# Altium schematic sheet WiFiSameScreen _STC15W4K48S4.SchDoc
size A3
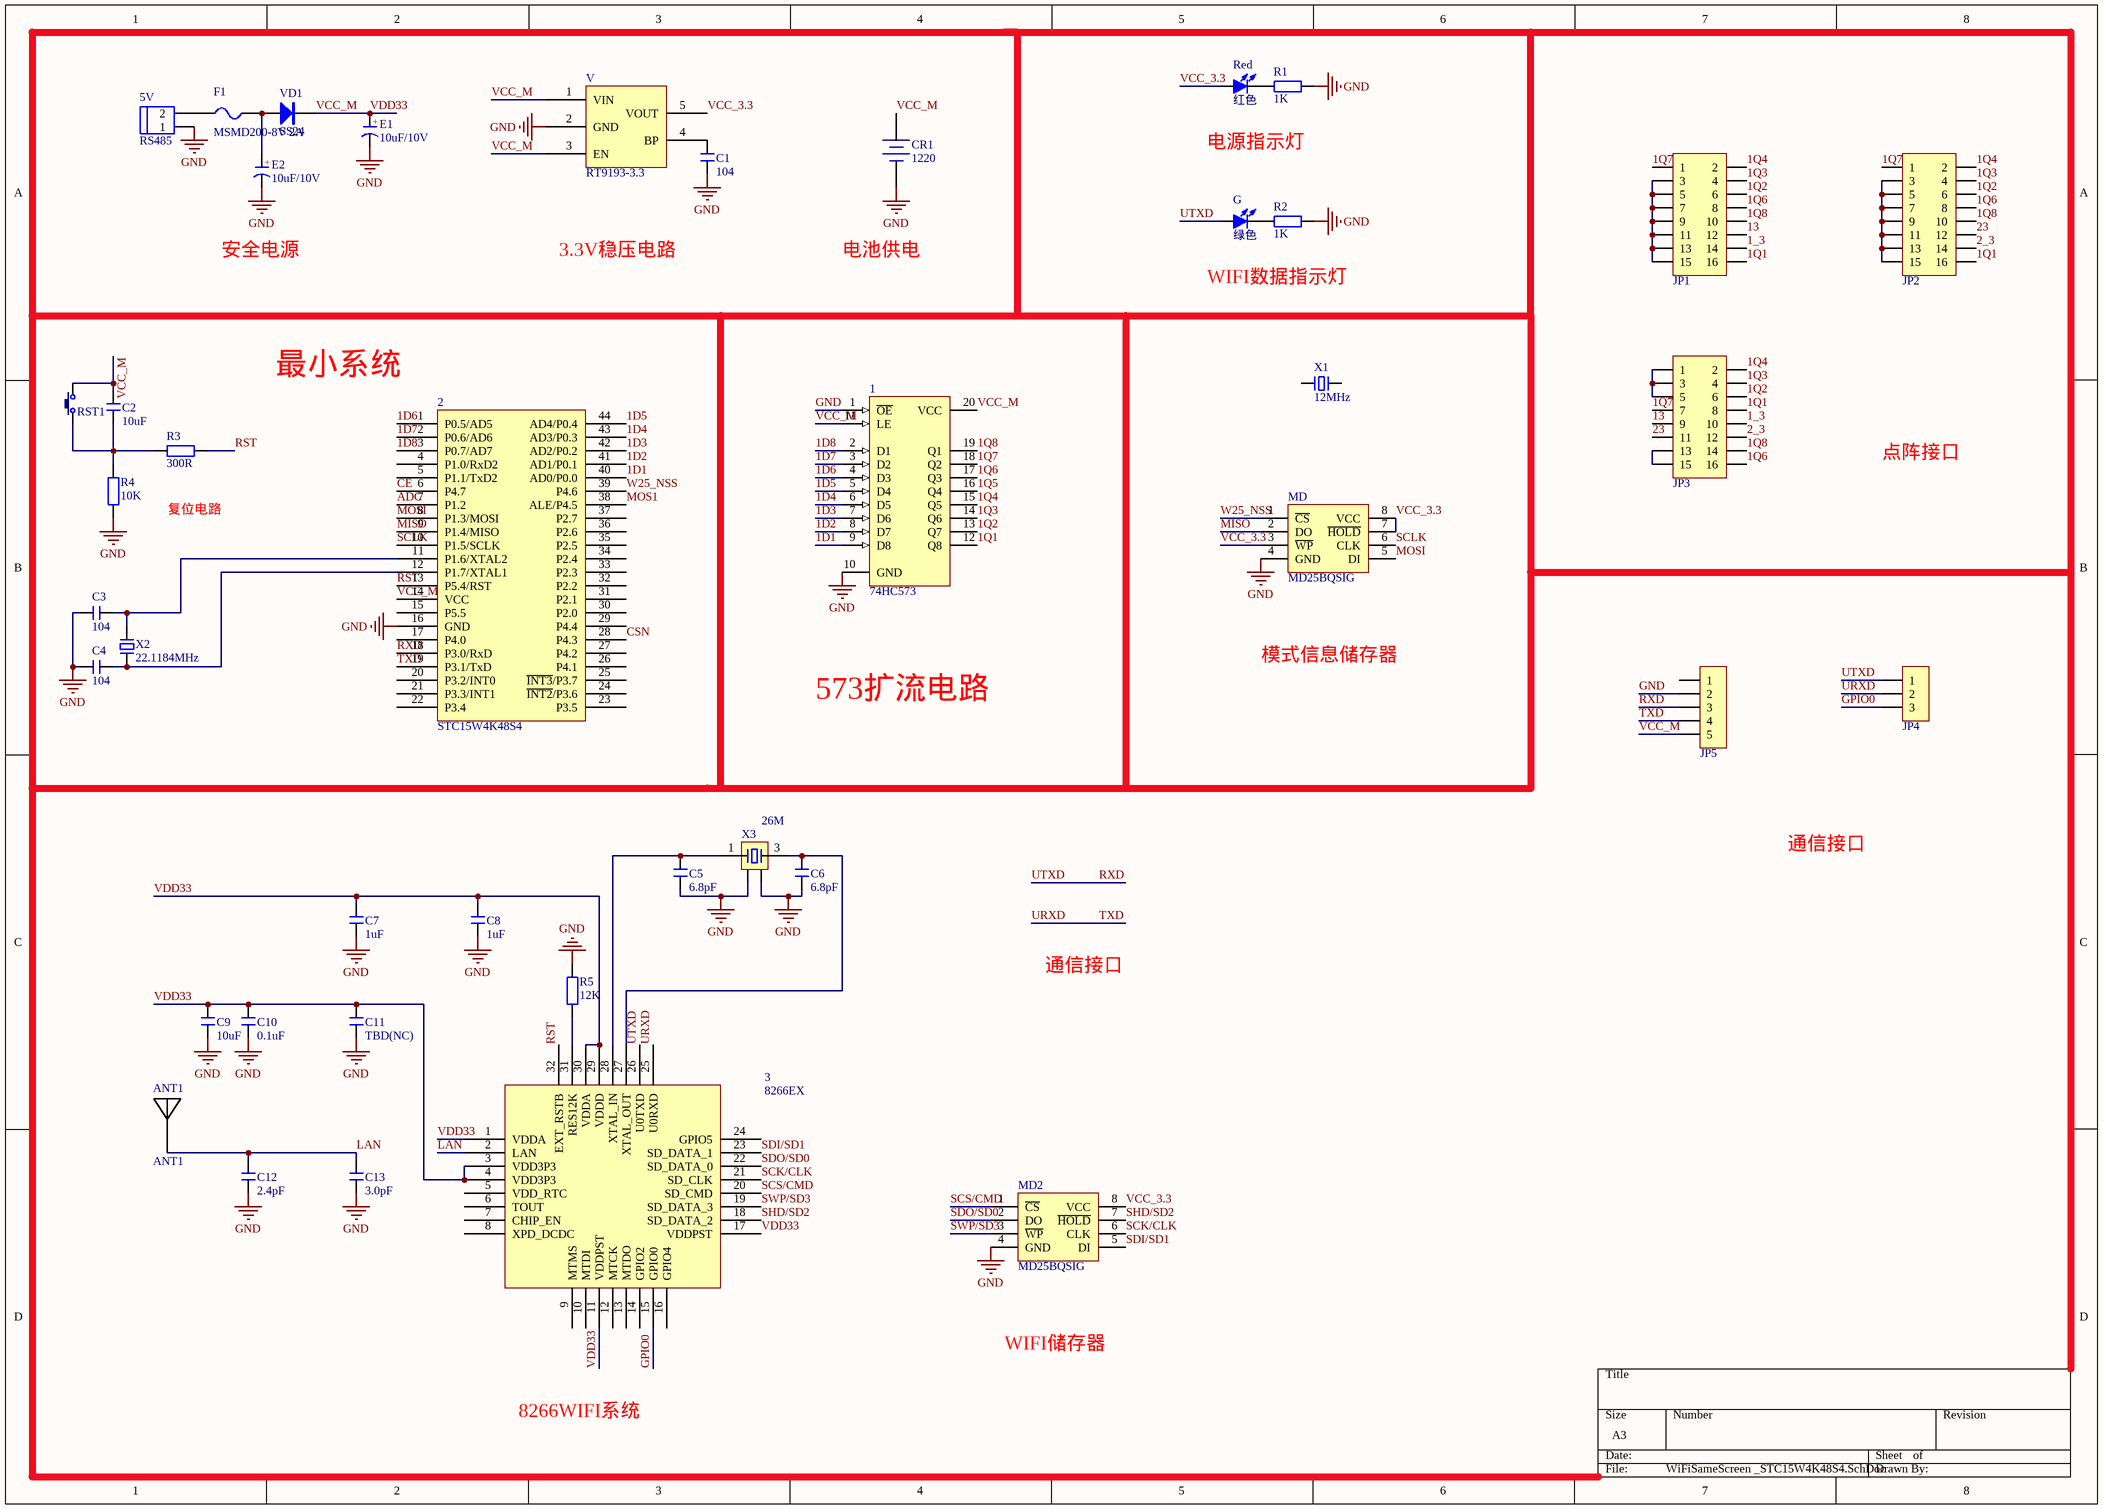
[diagram p0: WiFiSameScreen _STC15W4K48S4.SchDoc]

## Parts
1  74HC573  [TSSOP20_N]
2  STC15W4K48S4  [LQFP44 10X10_L]
3  8266EX  [QFN32 5x5_M]
5V  RS485  [KF7620-2P]
ANT1  ANT1  [2.4GANTF2]
C1  104  [C 0603]
C2  10uF  [C 0603]
C3  104  [C 0603]
C4  104  [C 0603]
C5  6.8pF  [C 0603]
C6  6.8pF  [C 0603]
C7  1uF  [C 0603]
C8  1uF  [C 0603]
C9  10uF  [C 0603]
C10  0.1uF  [C 0603]
C11  TBD(NC)  [C 0603]
C12  2.4pF  [C 0603]
C13  3.0pF  [C 0603]
CR1  1220  [CR1220_B]
E1  10uF/10V  [CAP 1.5*4*8]
E2  10uF/10V  [CAP 1.5*4*8]
F1  MSMD200-8V 2A  [FU 1206]
G  绿色  [LED 0603G]
JP1  Header 8X2  [HDR2.54-LI-2x8P]  (value not drawn)
JP2  Header 8X2  [HDR2.54-LI-2x8P]  (value not drawn)
JP3  Header 8X2  [HDR2.54-LI-2x8P]  (value not drawn)
JP4  HDR-1X3  [HDR-1X3]  (value not drawn)
JP5  HDR-1X5  [HDR2.54-LI-5P]  (value not drawn)
MD  MD25BQSIG  [SOP8W_L]
MD2  MD25BQSIG  [SOP8W_L]
R1  1K  [R 0603]
R2  1K  [R 0603]
R3  300R  [R 0603]
R4  10K  [R 0603]
R5  12K  [R 0603]
Red  红色  [LED 0603R]
RST1  3x6x5  [TSW DIP-6*6*5]  (value not drawn)
V  RT9193-3.3  [SOT23-5L]
VD1  SS24  [SMB]
X1  12MHz  [OSC-2x6-WI-B]
X2  22.1184MHz  [XTAL-49S DIP]
X3  26M  [OSC 2025-4P]

## Nets
GND: 1.1(~{OE}) 1.10(GND) 2.16(GND) 5V.1 C1.1 C3.1 C4.1 C5.1 C6.1 C7.1 C8.1 C9.1 C10.1 C11.1 C12.1 C13.1 CR1.2(DC-) E1.2(K) E2.2(K) JP5.2 MD.4(GND) MD2.4(GND) R1.2 R2.2 R4.1 R5.2 V.2(GND) X3.2 X3.4
1_3: JP1.14 JP3.10
1D1: 1.9(D8) 2.40(AD0/P0.0)
1D2: 1.8(D7) 2.41(AD1/P0.1)
1D3: 1.7(D6) 2.42(AD2/P0.2)
1D4: 1.6(D5) 2.43(AD3/P0.3)
1D5: 1.5(D4) 2.44(AD4/P0.4)
1D6: 1.4(D3) 2.1(P0.5/AD5)
1D7: 1.3(D2) 2.2(P0.6/AD6)
1D8: 1.2(D1) 2.3(P0.7/AD7)
1Q1: 1.12(Q8) JP1.16 JP2.16 JP3.8
1Q2: 1.13(Q7) JP1.6 JP2.6 JP3.6
1Q3: 1.14(Q6) JP1.4 JP2.4 JP3.4
1Q4: 1.15(Q5) JP1.2 JP2.2 JP3.2
1Q5: 1.16(Q4)
1Q6: 1.17(Q3) JP1.8 JP2.8 JP3.16
1Q7: 1.18(Q2) JP1.1 JP2.1 JP3.7
1Q8: 1.19(Q1) JP1.10 JP2.10 JP3.14
2_3: JP2.14 JP3.12
13: JP1.12 JP3.9
23: JP2.12 JP3.11
ADC: 2.7(P1.2)
CE: 2.6(P4.7)
CSN: 2.28(P4.3)
GPIO0: 3.15(GPIO0) JP4.3
LAN: 3.2(LAN) ANT1.1 C12.2 C13.2
MISO: 2.9(P1.4/MISO) MD.2(DO)
MOS1: 2.38(ALE/P4.5)
MOSI: 2.8(P1.3/MOSI) MD.5(DI)
RST: 2.13(P5.4/RST) 3.32(EXT_RSTB) R3.1
RXD: 2.18(P3.0/RxD) 3.26(U0TXD) G.1(A) JP4.1 JP5.3  [also labelled UTXD]
SCK/CLK: 3.21(SD_CLK) MD2.6(CLK)
SCLK: 2.10(P1.5/SCLK) MD.6(CLK)
SCS/CMD: 3.20(SD_CMD) MD2.1(~{CS})
SDI/SD1: 3.23(SD_DATA_1) MD2.5(DI)
SDO/SD0: 3.22(SD_DATA_0) MD2.2(DO)
SHD/SD2: 3.18(SD_DATA_2) MD2.7(~{HOLD})
SWP/SD3: 3.19(SD_DATA_3) MD2.3(~{WP})
TXD: 2.19(P3.1/TxD) 3.25(U0RXD) JP4.2 JP5.4  [also labelled URXD]
VCC_3.3: MD.3(~{WP}) MD.7(~{HOLD}) MD.8(VCC) MD2.8(VCC) Red.1(A) V.5(VOUT)
VCC_M: 1.11(LE) 1.20(VCC) 2.14(VCC) 3.1(VDDA) 3.3(VDD3P3) 3.4(VDD3P3) 3.11(VDDPST) 3.17(VDDPST) 3.29(VDDD) 3.30(VDDA) C2.2 C7.2 C8.2 C9.2 C10.2 C11.2 CR1.1(DC+) E1.1(A) JP5.5 RST1.2 V.1(VIN) V.3(EN) VD1.2(K)  [also labelled VDD33]
W25_NSS: 2.39(P4.6) MD.1(~{CS})
Net2_11: 2.11(P1.6/XTAL2) C3.2 X2.2
Net2_12: 2.12(P1.7/XTAL1) C4.2 X2.1
Net3_27: 3.27(XTAL_OUT) C6.2 X3.3
Net3_28: 3.28(XTAL_IN) C5.2 X3.1
Net3_31: 3.31(RES12K) R5.1
Net5V_2: 5V.2 F1.1
NetC1_2: C1.2 V.4(BP)
NetC2_1: C2.1 R3.2 R4.2 RST1.1
NetE2_1: E2.1(A) F1.2 VD1.1(A)
NetG_2: G.2(K) R2.1
NetJP1_3: JP1.3 JP1.5 JP1.7 JP1.9 JP1.11 JP1.13 JP1.15
NetJP2_3: JP2.3 JP2.5 JP2.7 JP2.9 JP2.11 JP2.13 JP2.15
NetJP3_1: JP3.1 JP3.3 JP3.5
NetJP3_13: JP3.13 JP3.15
NetR1_1: R1.1 Red.2(K)

Not connected (* = marked no-connect by the designer): 2 4(P1.0/RxD2) 5(P1.1/TxD2) 15(P5.5) 17(P4.0) 20(P3.2/INT0) 21(P3.3/INT1) 22(P3.4) 23(P3.5) 24(~{INT2}/P3.6) 25(~{INT3}/P3.7) 26(P4.1) 27(P4.2) 29(P4.4) 30(P2.0) 31(P2.1) 32(P2.2) 33(P2.3) 34(P2.4) 35(P2.5) 36(P2.6) 37(P2.7); 3 5(VDD_RTC) 6(TOUT) 7(CHIP_EN) 8(XPD_DCDC) 9(MTMS) 10(MTDI) 12(MTCK) 13(MTDO) 14(GPIO2) 16(GPIO4) 24(GPIO5); JP5 1; X1 1 2

## Notes on the sheet
- 电源指示灯
- 安全电源
- 3.3V稳压电路
- 电池供电
- WIFI数据指示灯
- 最小系统
- 复位电路
- 点阵接口
- 573扩流电路
- 模式信息储存器
- 通信接口
- WIFI储存器
- 8266WIFI系统
- (in symbol C-CT) +

## Library data of the parts
1 = 74HC573: D类三态输出锁存器; 版权归属: 源创客; BOM名称: 三态输出锁存器; 学习资源: www.ooocke.com
2 = STC15W4K48S4-44pin: STC单片机; 版权归属: 源创客; BOM名称: STC单片机; 学习资源: www.ooocke.com
3 = ESP8266: ESP; BOM名称: STC单片机; 版权归属: 源创客; 学习资源: www.ooocke.com
5V = HEAD2: KF301
ANT1 = ANT1: PCB板载天线; 版权归属: 源创客; BOM名称: PCB板载天线; 学习资源: www.ooocke.com
C1-C13 = C: 无极性贴片电容; 版权归属: 源创客; BOM名称: 无极性贴片电容; 学习资源: www.ooocke.com
CR1 = CR-3V: 微型电池; 版权归属: 源创客; BOM名称: 微型电池; 学习资源: www.ooocke.com
E1 E2 = C-CT: 贴片固态电容; 版权归属: 源创客; BOM名称: 贴片固态电容; 学习资源: www.ooocke.com
F1 = FU: 贴片保险丝; 版权归属: 源创客; BOM名称: 贴片保险丝; 学习资源: www.ooocke.com
G Red = LED-SMD: 贴片LED; 版权归属: 源创客; BOM名称: 贴片LED; 学习资源: www.ooocke.com
JP1-JP3 = Header 8X2: 8*2P接插件; 版权归属: 源创客; BOM名称: 8*2P接插件; 学习资源: www.ooocke.com
JP4 = Header 3: 3P接插件; 版权归属: 源创客; BOM名称: 3P接插件; 学习资源: www.ooocke.com
JP5 = Header 5: 5P接插件; 版权归属: 源创客; BOM名称: 5P接插件; 学习资源: www.ooocke.com
MD MD2 = W25Qxx: 外置Flash; 版权归属: 源创客; BOM名称: 外置Flash; 学习资源: www.ooocke.com
R1-R5 = R: 贴片电阻; 版权归属: 源创客; BOM名称: 贴片电阻; 学习资源: www.ooocke.com
RST1 = TSW 3x6: 3x6轻触开关; 版权归属: 源创客; BOM名称: 3x6轻触开关; 学习资源: www.ooocke.com
V = RT9193: LOD稳压芯片; BOM名称: 稳压芯片; 版权归属: 源创客; 学习资源: www.ooocke.com
VD1 = SS24: 肖特基二极管; 版权归属: 源创客; 属性: 40V/2A; BOM名称: 肖特基二极管; 学习资源: www.ooocke.com
X1 X2 = XTAL-2: 2脚晶振; 版权归属: 源创客; BOM名称: 2脚晶振; 学习资源: www.ooocke.com
X3 = XTAL-4P: 4脚无源晶振; 版权归属: 源创客; BOM名称: 4脚无源晶振; 学习资源: www.ooocke.com